# Altium schematic sheet Схема блока RTC.SchDoc
size 420 x 297 mm; Address1: Address1; Address2: Address2; Address3: Address3; Address4: Address4; DocumentNumber: АБВГ.123456.001 Э3; SheetNumber: 1; Scale: 1:1; DocumentType: Схема электрическая принципиальная; FirstReferrence: АБВГ.123456.001
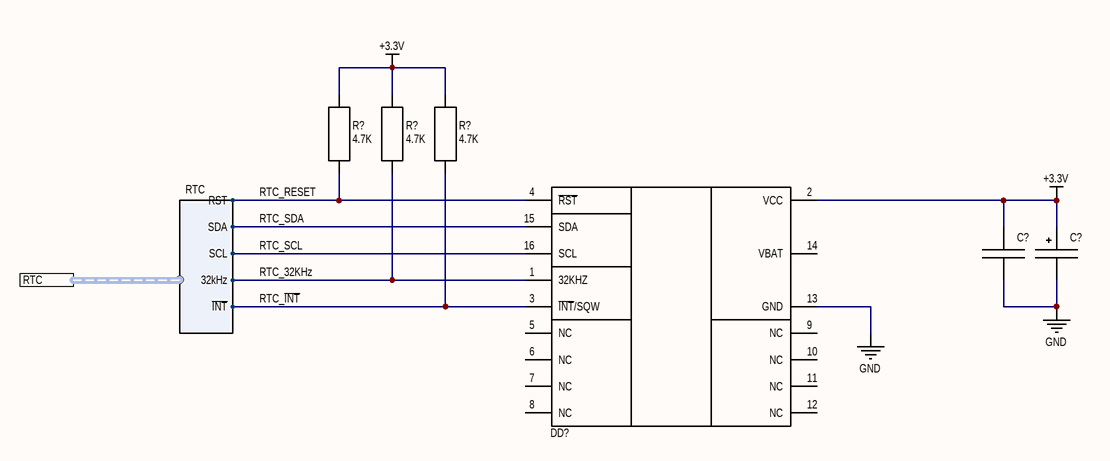
[diagram p0: Схема блока RTC.SchDoc]

## Parts
(Parts that share a designator on the sheet are numbered #1, #2 ... from top to bottom, then left to right.)
C?#1  *  [CH0603C]  (value not drawn)
C?#2  *  [TANTAL_A]  (value not drawn)
DD?  DS3231M+TRL  [SOIC127P1032X265-16N]  (value not drawn)
R?#1  4.7K  [CH0603R]
R?#2  4.7K  [CH0603R]
R?#3  4.7K  [CH0603R]

## Ports
RTC (harness RTC)

## Harnesses
RTC: RST, SDA, ~{INT}, SCL, 32kHz

## Nets
+3.3V: C?#1.1 C?#2.1 DD?.2(VCC) R?#1.2 R?#2.2 R?#3.2
GND: C?#1.2 C?#2.2 DD?.13(GND)
RTC_32KHz: DD?.1(32KHZ) R?#2.1 ; port RTC.32kHz
RTC_~{INT}: DD?.3(~{INT}/SQW) R?#3.1 ; port RTC.~{INT}
RTC_RESET: DD?.4(~{RST}) R?#1.1 ; port RTC.RST
RTC_SCL: DD?.16(SCL) ; port RTC.SCL
RTC_SDA: DD?.15(SDA) ; port RTC.SDA

Not connected (* = marked no-connect by the designer): DD? 5(NC) 6(NC) 7(NC) 8(NC) 9(NC) 10(NC) 11(NC) 12(NC) 14(VBAT)

## Notes on the sheet
- Подп. и дата
- Инв. № дубл.
- Взам. инв. №
- Инв. № подл.
- Изм.
- Лист
- № докум.
- Подп.
- Дата
- 2.106-A3
- Копировал
- Формат А3

## Library data of the parts
C?#1 = Capacitor: Manufacturer: *; Model: *; HelpURL: *; ComponentKind: *; Value: *
C?#2 = TantalCap: Manufacturer: *; Model: *; HelpURL: *; ComponentKind: *; Value: *
DD? = DS3231M+TRL: RTC IC Clock/Calendar - I²C, 2-Wire Serial; Package: None; Price: None; Value: *; MP: DS3231M+TRL; Availability: Unavailable
R?#1-R?#3 = Resistor: ComponentKind: 0603 (1608 Metric); Value: 4.7K